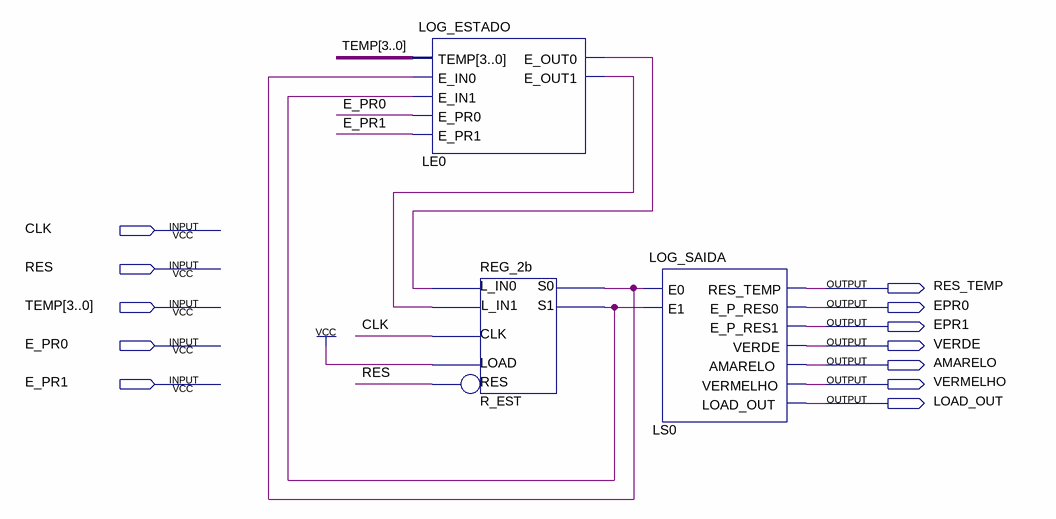
[diagram p0: schematic sheet]
// Quartus schematic FSM_SEMAFORO.bdf as structural Verilog: 3 symbols, 12 pins
module FSM_SEMAFORO (
  input  CLK,
  input  RES,
  input  [3:0] TEMP,
  input  E_PR0,
  input  E_PR1,
  output RES_TEMP,
  output EPR0,
  output EPR1,
  output VERDE,
  output AMARELO,
  output VERMELHO,
  output LOAD_OUT
);

  wire LE0_e_out0, LE0_e_out1, R_EST_s0, R_EST_s1;

  LOG_ESTADO LE0 (
    .TEMP(TEMP), .E_IN0(R_EST_s0), .E_IN1(R_EST_s1), .E_PR0(E_PR0), .E_PR1(E_PR1), .E_OUT0(LE0_e_out0),
    .E_OUT1(LE0_e_out1));
  REG_2b R_EST (
    .L_IN0(LE0_e_out0), .L_IN1(LE0_e_out1), .LOAD(1'b1), .CLK(CLK), .RES(RES), .S0(R_EST_s0), .S1(R_EST_s1));
  LOG_SAIDA LS0 (
    .E0(R_EST_s0), .E1(R_EST_s1), .RES_TEMP(RES_TEMP), .E_P_RES0(EPR0), .E_P_RES1(EPR1), .VERDE(VERDE),
    .AMARELO(AMARELO), .VERMELHO(VERMELHO), .LOAD_OUT(LOAD_OUT));
endmodule
